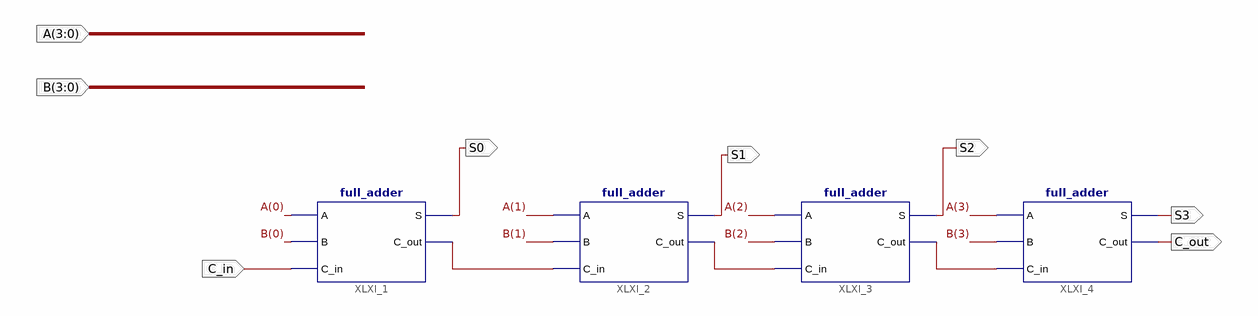
[diagram p0: schematic sheet 1]
// Xilinx ISE schematic four_bit_adder.sch (artix7) as structural Verilog: 4 symbols, 8 ports
module four_bit_adder (
  input  [3:0] A,
  input  [3:0] B,
  input  C_in,
  output S0,
  output S1,
  output S2,
  output S3,
  output C_out
);

  wire XLXN_11, XLXN_12, XLXN_13;

  full_adder XLXI_1 (.A(A[0]), .B(B[0]), .C_in(C_in), .C_out(XLXN_11), .S(S0));
  full_adder XLXI_2 (.A(A[1]), .B(B[1]), .C_in(XLXN_11), .C_out(XLXN_12), .S(S1));
  full_adder XLXI_3 (.A(A[2]), .B(B[2]), .C_in(XLXN_12), .C_out(XLXN_13), .S(S2));
  full_adder XLXI_4 (.A(A[3]), .B(B[3]), .C_in(XLXN_13), .C_out(C_out), .S(S3));
endmodule
